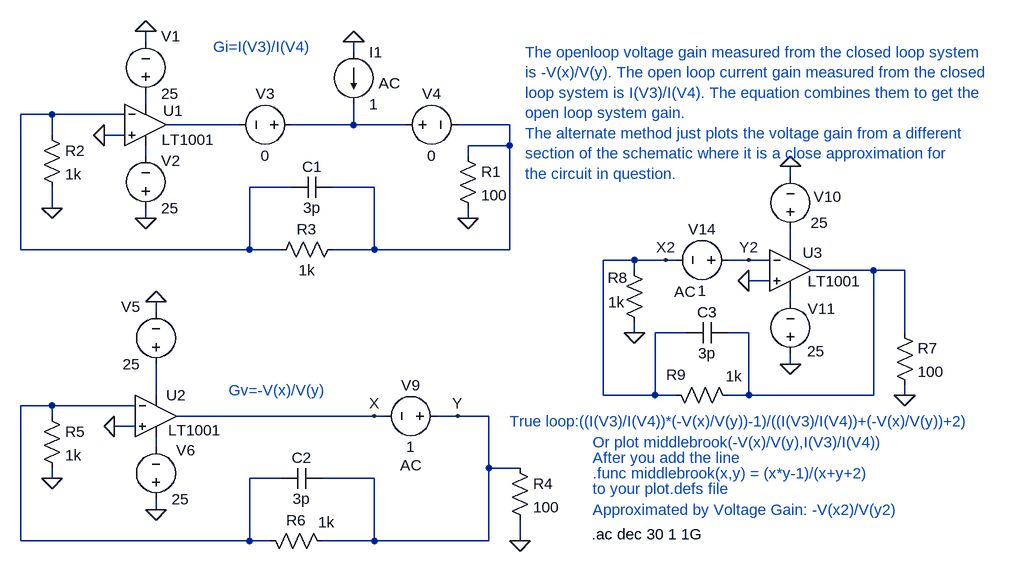
[diagram p0: schematic LoopGain2.asc]
LoopGain2.asc, the LTspice schematic file:
Version 4
SHEET 1 2168 1300
WIRE -96 384 -96 176
WIRE -96 832 -96 624
WIRE -48 176 -96 176
WIRE -48 208 -48 176
WIRE -48 320 -48 288
WIRE -48 624 -96 624
WIRE -48 640 -48 624
WIRE -48 736 -48 720
WIRE 64 176 -48 176
WIRE 64 208 32 208
WIRE 80 624 -48 624
WIRE 80 656 48 656
WIRE 96 64 96 48
WIRE 96 160 96 144
WIRE 96 240 96 224
WIRE 96 336 96 320
WIRE 112 480 112 464
WIRE 112 608 112 560
WIRE 112 688 112 672
WIRE 112 784 112 768
WIRE 240 192 128 192
WIRE 256 384 -96 384
WIRE 256 384 256 288
WIRE 256 832 -96 832
WIRE 256 832 256 736
WIRE 288 832 256 832
WIRE 304 384 256 384
WIRE 304 736 256 736
WIRE 320 288 256 288
WIRE 416 80 416 64
WIRE 416 192 320 192
WIRE 416 192 416 160
WIRE 448 288 384 288
WIRE 448 384 384 384
WIRE 448 384 448 288
WIRE 448 640 144 640
WIRE 448 736 368 736
WIRE 448 832 368 832
WIRE 448 832 448 736
WIRE 464 640 448 640
WIRE 496 192 416 192
WIRE 576 640 544 640
WIRE 592 240 592 224
WIRE 592 336 592 320
WIRE 624 640 576 640
WIRE 624 720 624 640
WIRE 624 832 448 832
WIRE 624 832 624 720
WIRE 656 192 576 192
WIRE 656 224 592 224
WIRE 656 224 656 192
WIRE 656 384 448 384
WIRE 656 384 656 224
WIRE 672 720 624 720
WIRE 672 832 672 800
WIRE 800 608 800 400
WIRE 848 400 800 400
WIRE 848 416 848 400
WIRE 848 512 848 496
WIRE 880 608 800 608
WIRE 880 608 880 512
WIRE 896 400 848 400
WIRE 912 400 896 400
WIRE 912 608 880 608
WIRE 928 512 880 512
WIRE 1024 400 992 400
WIRE 1024 512 992 512
WIRE 1024 608 992 608
WIRE 1024 608 1024 512
WIRE 1056 400 1024 400
WIRE 1056 432 1024 432
WIRE 1088 272 1088 256
WIRE 1088 384 1088 352
WIRE 1088 464 1088 448
WIRE 1088 560 1088 544
WIRE 1216 416 1120 416
WIRE 1216 608 1024 608
WIRE 1216 608 1216 416
WIRE 1264 416 1216 416
WIRE 1264 512 1264 416
WIRE 1264 608 1264 592
FLAG 416 64 0
FLAG 96 48 0
FLAG 96 336 0
FLAG 32 208 0
FLAG -48 320 0
FLAG 592 336 0
FLAG 112 464 0
FLAG 112 784 0
FLAG 48 656 0
FLAG -48 736 0
FLAG 672 832 0
FLAG 448 640 X
FLAG 576 640 Y
FLAG 1088 256 0
FLAG 1088 560 0
FLAG 1024 432 0
FLAG 848 512 0
FLAG 1264 608 0
FLAG 896 400 X2
FLAG 1024 400 Y2
SYMBOL voltage 96 160 M180
WINDOW 0 24 104 Left 0
WINDOW 3 24 16 Left 0
WINDOW 123 0 0 Left 0
WINDOW 39 0 0 Left 0
SYMATTR InstName V1
SYMATTR Value 25
SYMBOL voltage 96 336 M180
WINDOW 0 24 89 Left 0
WINDOW 3 24 16 Left 0
WINDOW 123 0 0 Left 0
WINDOW 39 0 0 Left 0
SYMATTR InstName V2
SYMATTR Value 25
SYMBOL current 416 80 R0
WINDOW 38 39 48 Left 0
SYMATTR SpiceModel AC
SYMATTR InstName I1
SYMATTR Value 1
SYMBOL voltage 336 192 R90
WINDOW 0 -32 56 VBottom 0
WINDOW 3 32 56 VTop 0
SYMATTR InstName V3
SYMATTR Value 0
SYMBOL voltage 480 192 R270
WINDOW 0 32 56 VTop 0
WINDOW 3 -32 56 VBottom 0
WINDOW 123 0 0 Left 0
WINDOW 39 0 0 Left 0
SYMATTR InstName V4
SYMATTR Value 0
SYMBOL res 576 224 R0
SYMATTR InstName R1
SYMATTR Value 100
SYMBOL res -64 192 R0
SYMATTR InstName R2
SYMATTR Value 1k
SYMBOL res 400 368 R90
WINDOW 0 0 56 VBottom 0
WINDOW 3 32 56 VTop 0
SYMATTR InstName R3
SYMATTR Value 1k
SYMBOL cap 384 272 R90
WINDOW 0 0 32 VBottom 0
WINDOW 3 32 32 VTop 0
SYMATTR InstName C1
SYMATTR Value 3p
SYMBOL Opamps\\LT1001 96 128 R0
WINDOW 0 27 42 Left 0
WINDOW 3 25 87 Left 0
SYMATTR InstName U1
SYMBOL voltage 112 576 R180
WINDOW 0 24 104 Left 0
WINDOW 3 24 16 Left 0
WINDOW 123 0 0 Left 0
WINDOW 39 0 0 Left 0
SYMATTR InstName V5
SYMATTR Value 25
SYMBOL voltage 112 784 M180
WINDOW 0 31 91 Left 0
WINDOW 3 24 16 Left 0
WINDOW 123 0 0 Left 0
WINDOW 39 0 0 Left 0
SYMATTR InstName V6
SYMATTR Value 25
SYMBOL res 656 704 R0
SYMATTR InstName R4
SYMATTR Value 100
SYMBOL res -64 624 R0
SYMATTR InstName R5
SYMATTR Value 1k
SYMBOL res 384 848 M270
WINDOW 0 32 56 VTop 0
WINDOW 3 60 10 VBottom 0
SYMATTR InstName R6
SYMATTR Value 1k
SYMBOL cap 368 752 M270
WINDOW 0 32 32 VTop 0
WINDOW 3 0 32 VBottom 0
SYMATTR InstName C2
SYMATTR Value 3p
SYMBOL Opamps\\LT1001 112 576 R0
WINDOW 3 19 86 Left 0
SYMATTR InstName U2
SYMBOL voltage 560 640 R90
WINDOW 0 -32 56 VBottom 0
WINDOW 3 32 56 VTop 0
WINDOW 38 60 56 VTop 0
SYMATTR InstName V9
SYMATTR Value 1
SYMATTR SpiceModel AC
SYMBOL voltage 1088 368 M180
WINDOW 0 36 65 Left 0
WINDOW 3 31 25 Left 0
WINDOW 123 0 0 Left 0
WINDOW 39 0 0 Left 0
SYMATTR InstName V10
SYMATTR Value 25
SYMBOL voltage 1088 560 M180
WINDOW 0 27 85 Left 0
WINDOW 3 26 20 Left 0
WINDOW 123 0 0 Left 0
WINDOW 39 0 0 Left 0
SYMATTR InstName V11
SYMATTR Value 25
SYMBOL res 1248 496 R0
SYMATTR InstName R7
SYMATTR Value 100
SYMBOL res 832 400 R0
WINDOW 0 -25 27 Left 0
WINDOW 3 -24 65 Left 0
SYMATTR InstName R8
SYMATTR Value 1k
SYMBOL res 1008 624 M270
WINDOW 0 32 96 VTop 0
WINDOW 3 61 7 VBottom 0
SYMATTR InstName R9
SYMATTR Value 1k
SYMBOL cap 992 528 M270
WINDOW 0 32 32 VTop 0
WINDOW 3 0 32 VBottom 0
SYMATTR InstName C3
SYMATTR Value 3p
SYMBOL Opamps\\LT1001 1088 352 R0
WINDOW 0 19 37 Left 0
WINDOW 3 27 81 Left 0
SYMATTR InstName U3
SYMBOL voltage 1008 400 R90
WINDOW 0 -32 56 VBottom 0
WINDOW 3 32 56 VTop 0
WINDOW 38 33 82 VTop 0
SYMATTR InstName V14
SYMATTR Value 1
SYMATTR SpiceModel AC
TEXT 782 822 Left 0 !.ac dec 30 1 1G
TEXT 224 600 Left 0 ;Gv=-V(x)/V(y)
TEXT 200 72 Left 0 ;Gi=I(V3)/I(V4)
TEXT 656 648 Left 0 ;True loop:((I(V3)/I(V4))*(-V(x)/V(y))-1)/((I(V3)/I(V4))+(-V(x)/V(y))+2)
TEXT 784 784 Left 0 ;Approximated by Voltage Gain: -V(x2)/V(y2)
TEXT 784 680 Left 0 ;Or plot middlebrook(-V(x)/V(y),I(V3)/I(V4))
TEXT 784 704 Left 0 ;After you add the line
TEXT 784 728 Left 0 ;.func middlebrook(x,y) = (x*y-1)/(x+y+2)
TEXT 784 752 Left 0 ;to your plot.defs file
TEXT 680 80 Left 0 ;The openloop voltage gain measured from the closed loop system\nis -V(x)/V(y). The open loop current gain measured from the closed\nloop system is I(V3)/I(V4). The equation combines them to get the\nopen loop system gain.\nThe alternate method just plots the voltage gain from a different\nsection of the schematic where it is a close approximation for\nthe circuit in question.

The netlist it stands for:
* LoopGain2.asc
V1 N003 0 25
V2 0 N004 25
I1 0 N008 AC 1
V3 N008 N007 0
V4 N008 N009 0
R1 N009 0 100
R2 N001 0 1k
R3 N009 N001 1k
C1 N009 N001 3p
XU1 0 N001 N003 N004 N007 LT1001  ; pins In+ In- V+ V- OUT
V5 N005 0 25
V6 0 N006 25
R4 Y 0 100
R5 N002 0 1k
R6 Y N002 1k
C2 Y N002 3p
XU2 0 N002 N005 N006 X LT1001  ; pins In+ In- V+ V- OUT
V9 Y X AC 1
V10 N011 0 25
V11 0 N012 25
R7 N010 0 100
R8 X2 0 1k
R9 N010 X2 1k
C3 N010 X2 3p
XU3 0 Y2 N011 N012 N010 LT1001  ; pins In+ In- V+ V- OUT
V14 Y2 X2 AC 1
.ac dec 30 1 1G
* Gv=-V(x)/V(y)
* Gi=I(V3)/I(V4)
* True loop:((I(V3)/I(V4))*(-V(x)/V(y))-1)/((I(V3)/I(V4))+(-V(x)/V(y))+2)
* Approximated by Voltage Gain: -V(x2)/V(y2)
* Or plot middlebrook(-V(x)/V(y),I(V3)/I(V4))
* After you add the line
* .func middlebrook(x,y) = (x*y-1)/(x+y+2)
* to your plot.defs file
* The openloop voltage gain measured from the closed loop system
* is -V(x)/V(y). The open loop current gain measured from the closed
* loop system is I(V3)/I(V4). The equation combines them to get the
* open loop system gain.
* The alternate method just plots the voltage gain from a different
* section of the schematic where it is a close approximation for
* the circuit in question.
.lib LTC.lib
.backanno
.end